# Altium schematic sheet BoardA-Storage.SchDoc
size A; SheetNumber: 5; SheetTotal: 9
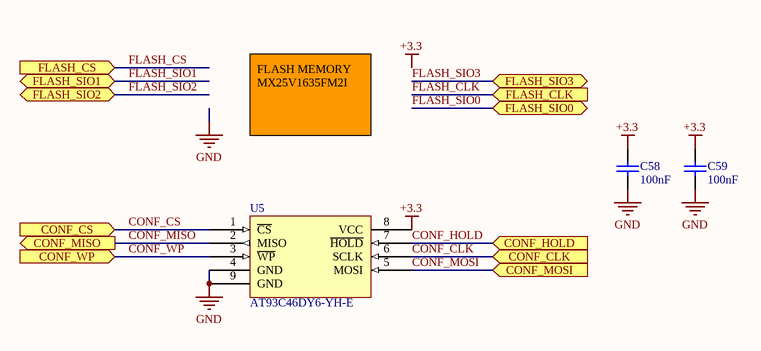
[diagram p0: BoardA-Storage.SchDoc]

## Parts
C58  100nF  [CAPC0603X33X15ML03T05]
C59  100nF  [CAPC0603X33X15ML03T05]
U5  AT93C46DY6-YH-E  [AT93C46DY6-YH-E]

## Ports
CONF_CLK (in), CONF_CS (in), CONF_HOLD (in), CONF_MISO (out), CONF_MOSI (in), CONF_WP (in), FLASH_CLK (in), FLASH_CS (in), FLASH_SIO0 (bidir), FLASH_SIO1 (bidir), FLASH_SIO2 (bidir), FLASH_SIO3 (bidir)

## Nets
+3.3: C58.2 C59.2 U5.8(VCC)
GND: C58.1 C59.1 U5.4(GND) U5.9(GND)
CONF_CLK: U5.6(SCLK) ; port CONF_CLK
CONF_CS: U5.1(~{CS}) ; port CONF_CS
CONF_HOLD: U5.7(~{HOLD}) ; port CONF_HOLD
CONF_MISO: U5.2(MISO) ; port CONF_MISO
CONF_MOSI: U5.5(MOSI) ; port CONF_MOSI
CONF_WP: U5.3(~{WP}) ; port CONF_WP
FLASH_CLK: port FLASH_CLK
FLASH_CS: port FLASH_CS
FLASH_SIO0: port FLASH_SIO0
FLASH_SIO1: port FLASH_SIO1
FLASH_SIO2: port FLASH_SIO2
FLASH_SIO3: port FLASH_SIO3

## Notes on the sheet
- FLASH MEMORY MX25V1635FM2I
- Labels drawn without touching a wire or pin: +3.3

## Library data of the parts
C58 C59 = CMP-2010-00674-1: Manufacturer: Samsung; Part Number: CL03A104KQ3NNNC
U5 = AT93C46DY6-YH-E: EEPROM Memory IC 1Kb (128 x 8, 64 x 16) SPI 8-UDFN (2x3); Manufacturer: Microchip; Manufacturer Part Number: AT25040B-MAHL-E; RoHS: Yes; Supplier 1: Digi-Key; Supplier Part Number 1: AT93C46DY6-YH-ECT-ND